# EasyEDA schematic Stepper_Control.json
TITLE: Stepper Control @ TOF sensor reading; REV: o.0; Date: 2022-05-19; Sheet: 1/1; Drawn By: AmirB@mada.org.il; Company: Blomfield Science Museum
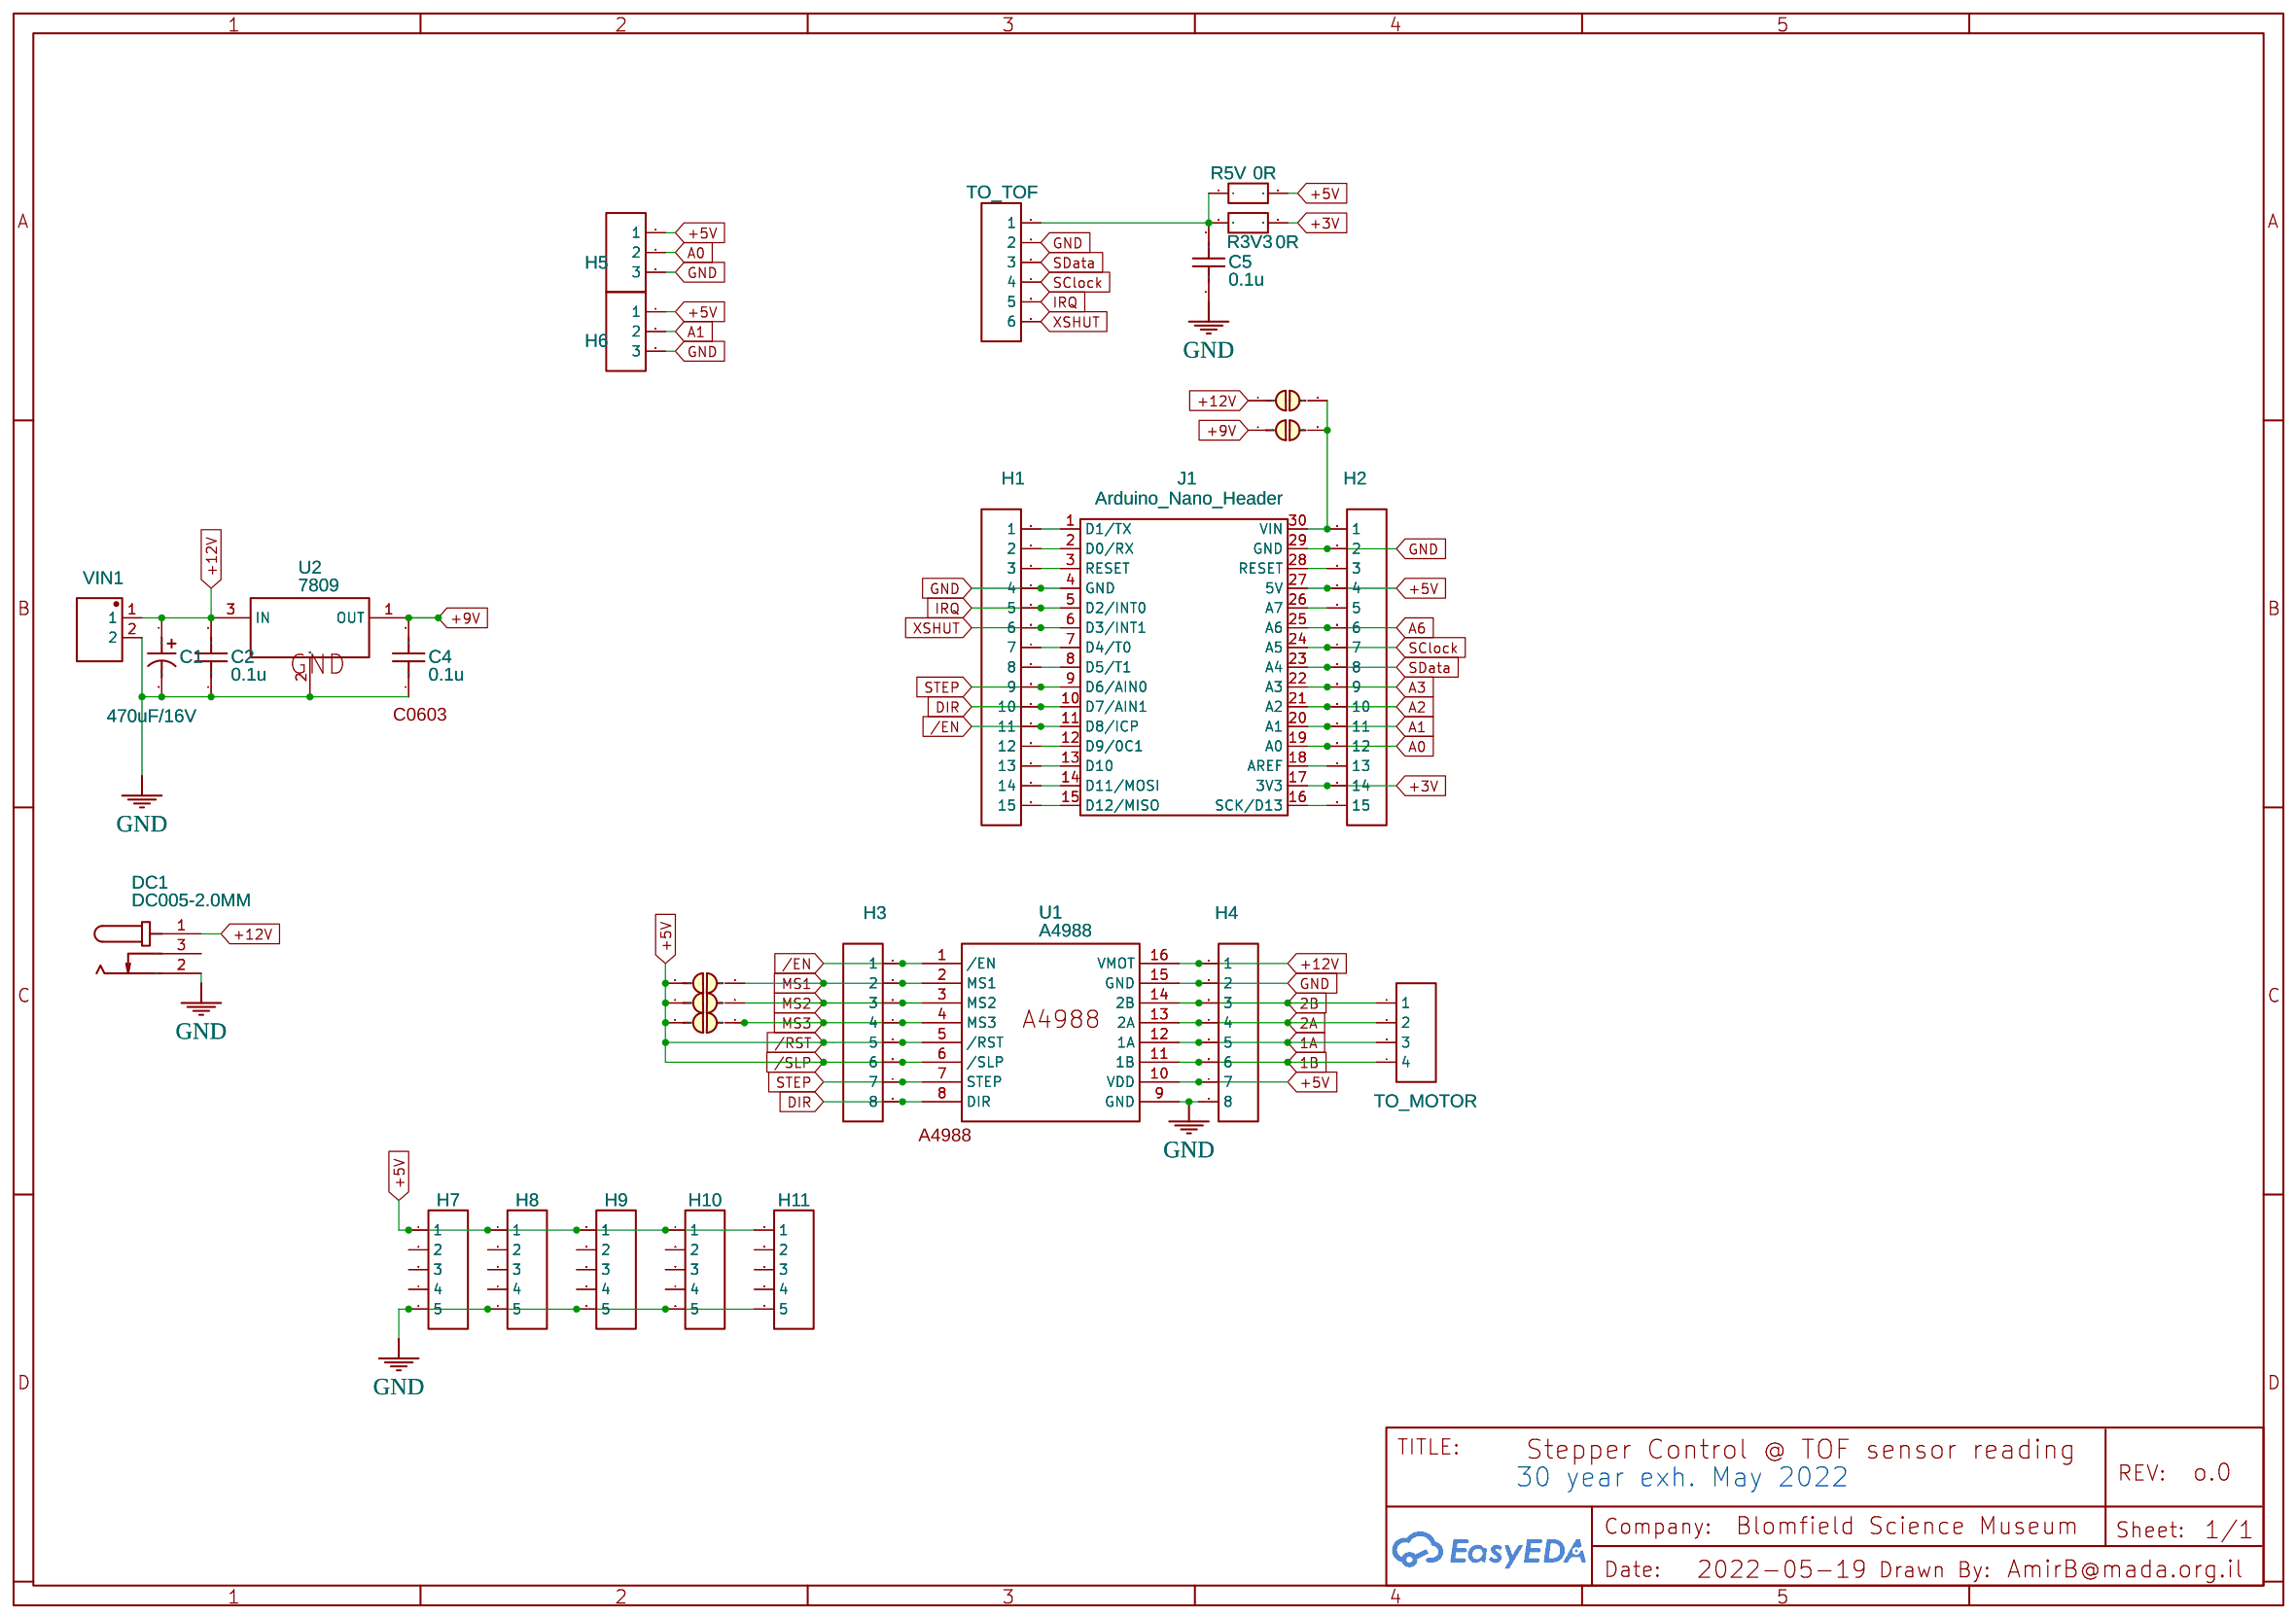
[diagram p0: schematic sheet]

## Parts
C1  470uF/16V  [CAP-TH_BD8.0-P3.50-D0.5-FD]
C2  0.1u  [C0603]
C4  0.1u  [C0603]
C5  0.1u  [C0603]
DC1  DC005-2.0MM  [DC-IN-TH_DC005]
H1  HDR-F-2.54_1x15  [HDR-F-2.54_1X15]
H2  HDR-F-2.54_1x15  [HDR-F-2.54_1X15]
H3  HDR-F-2.54_1x8  [HDR-F-2.54_1X8]
H4  HDR-F-2.54_1x8  [HDR-F-2.54_1X8]
H5  HDR-F-2.54_1x3  [HDR-F-2.54_1X3]
H6  HDR-F-2.54_1x3  [HDR-F-2.54_1X3]
H7  HDR-F-2.54_1x5  [HDR-F-2.54_1X5]
H8  HDR-F-2.54_1x5  [HDR-F-2.54_1X5]
H9  HDR-F-2.54_1x5  [HDR-F-2.54_1X5]
H10  HDR-F-2.54_1x5  [HDR-F-2.54_1X5]
H11  HDR-F-2.54_1x5  [HDR-F-2.54_1X5]
J1  Arduino_Nano_Header  [DIP-30_L43.18-W15.24-ARDUINONANO]
J9V  JUMPER-SMT_2  [JUMPERS_SMT-JUMPER_2_NC_PASTE_NO-SILK]
J12V  JUMPER-SMT_2  [JUMPERS_SMT-JUMPER_2_NC_PASTE_NO-SILK]
JP1  JUMPER-SMT_2  [JUMPERS_SMT-JUMPER_2_NC_PASTE_NO-SILK]
JP2  JUMPER-SMT_2  [JUMPERS_SMT-JUMPER_2_NC_PASTE_NO-SILK]
JP3  JUMPER-SMT_2  [JUMPERS_SMT-JUMPER_2_NC_PASTE_NO-SILK]
R3V3  0R  [R0603]
R5V  0R  [R0603]
TO_MOTOR  HDR-F-2.54_1x4  [HDR-F-2.54_1X4]
TO_TOF  HDR-F-2.54_1x6  [HDR-F-2.54_1X6]
U1  A4988  [A4988]
U2  7809  [SOT-89-3_L4.5-W2.5-P1.50-LS4.2-BR]
VIN1  640456-2  [CONN-TH_KF2510-2A]

## Library data of the parts
C1 = 16V470UF CD110: Supplier: LCSC; Supplier Part: C2960230; Manufacturer: HRK(鸿瑞凯电子); Manufacturer Part: 16V470uF CD110; Contributor: LCSC; Package Display: No
C2 C5 = C_0603_US: Contributor: LCEDA_Lib; Package Display: No
C4 = C_0603_US: Contributor: LCEDA_Lib; Package Display: Yes
DC1 = DC005-2.0MM: Supplier: LCSC; Manufacturer: SOFNG; Supplier Part: C111567; Package Display: No
H1 H2 = HDR-F-2.54_1x15: Supplier Part: C124408; Supplier: LCSC; Contributor: LCEDA_Lib; Package Display: No
H3 H4 = HDR-F-2.54_1x8: Supplier Part: C225505; Supplier: LCSC; Contributor: LCEDA_Lib; Package Display: No
H5 H6 = HDR-F-2.54_1x3: Supplier Part: C146690; Supplier: LCSC; Contributor: LCEDA_Lib; Package Display: No
H7-H11 = HDR-F-2.54_1x5: Supplier Part: C50950; Supplier: LCSC; Contributor: LCEDA_Lib; Package Display: No
J1 = Arduino_Nano_Header
J9V J12V JP1-JP3 = JUMPER-SMT_2: Contributor: P-Thomsen; Package Display: No
R3V3 R5V = R_0603_EU: Contributor: LCEDA_Lib; Package Display: No
TO_MOTOR = HDR-F-2.54_1x4: Supplier Part: C225501; Supplier: LCSC; Contributor: LCEDA_Lib; Package Display: No
TO_TOF = HDR-F-2.54_1x6: Supplier Part: C40877; Supplier: LCSC; Contributor: LCEDA_Lib; Package Display: No
U1 = A4988: Contributor: unaja_closp; Package Display: Yes
U2 = 7805(SOT-89): Supplier: LCSC; Manufacturer: CJ; Manufacturer Part: CJ78L05; image: //image.lceda.cn/szlcsc/C2079.jpg; Supplier Part: C2079; Paste Type: expand; Contributor: LCEDA_Lib; Package Display: No
VIN1 = 640456-2: Supplier: LCSC; Manufacturer: TE Connectivity; Supplier Part: C86502; JLCPCB Part Class: Extended Part; Package Display: No

## Nets
+3V: H2.14 J1.17(3V3) R3V3.2
+5V: H2.4 H3.5 H3.6 H4.7 H5.1 H6.1 H7.1 H8.1 H9.1 H10.1 H11.1 J1.27(5V) JP1.1 JP2.1 JP3.1 R5V.2 U1.5(/RST) U1.6(/SLP) U1.10(VDD)
+9V: C4.2 J9V.1 U2.1(OUT)
+12V: C1.1 C2.2 DC1.1 H4.1 J12V.1 U1.16(VMOT) U2.3(IN) VIN1.1
GND: C1.2 C2.1 C4.1 C5.1 DC1.2 H1.4 H2.2 H4.2 H4.8 H5.3 H6.3 H7.5 H8.5 H9.5 H10.5 H11.5 J1.4(GND) J1.29(GND) TO_TOF.2 U1.9(GND) U1.15(GND) U2.2(GND) VIN1.2
1A: H4.5 TO_MOTOR.3 U1.12(1A)
1B: H4.6 TO_MOTOR.4 U1.11(1B)
2A: H4.4 TO_MOTOR.2 U1.13(2A)
2B: H4.3 TO_MOTOR.1 U1.14(2B)
/EN: H1.11 H3.1 J1.11(D8/ICP) U1.1(/EN)
A0: H2.12 H5.2 J1.19(A0)
A1: H2.11 H6.2 J1.20(A1)
A2: H2.10 J1.21(A2)
A3: H2.9 J1.22(A3)
A6: H2.6 J1.25(A6)
DIR: H1.10 H3.8 J1.10(D7/AIN1) U1.8(DIR)
IRQ: H1.5 J1.5(D2/INT0) TO_TOF.5
MS1: H3.2 JP1.2 U1.2(MS1)
MS2: H3.3 JP2.2 U1.3(MS2)
MS3: H3.4 JP3.2 U1.4(MS3)
SClock: H2.7 J1.24(A5) TO_TOF.4
SData: H2.8 J1.23(A4) TO_TOF.3
STEP: H1.9 H3.7 J1.9(D6/AIN0) U1.7(STEP)
XSHUT: H1.6 J1.6(D3/INT1) TO_TOF.6
Net-(C5-2): C5.2 R3V3.1 R5V.1 TO_TOF.1
Net-(H1-1): H1.1 J1.1(D1/TX)
Net-(H1-2): H1.2 J1.2(D0/RX)
Net-(H1-3): H1.3 J1.3(RESET)
Net-(H1-7): H1.7 J1.7(D4/T0)
Net-(H1-8): H1.8 J1.8(D5/T1)
Net-(H1-12): H1.12 J1.12(D9/0C1)
Net-(H1-13): H1.13 J1.13(D10)
Net-(H1-14): H1.14 J1.14(D11/MOSI)
Net-(H1-15): H1.15 J1.15(D12/MISO)
Net-(H2-1): H2.1 J1.30(VIN) J9V.2 J12V.2
Net-(H2-3): H2.3 J1.28(RESET)
Net-(H2-5): H2.5 J1.26(A7)
Net-(H2-13): H2.13 J1.18(AREF)
Net-(H2-15): H2.15 J1.16(SCK/D13)

Not connected (* = marked no-connect by the designer): DC1 3; H7 2 3 4; H8 2 3 4; H9 2 3 4; H10 2 3 4; H11 2 3 4

## Notes on the sheet
- 30 year exh. May 2022
